# EAGLE schematic clock (EAGLE 7.1.0)
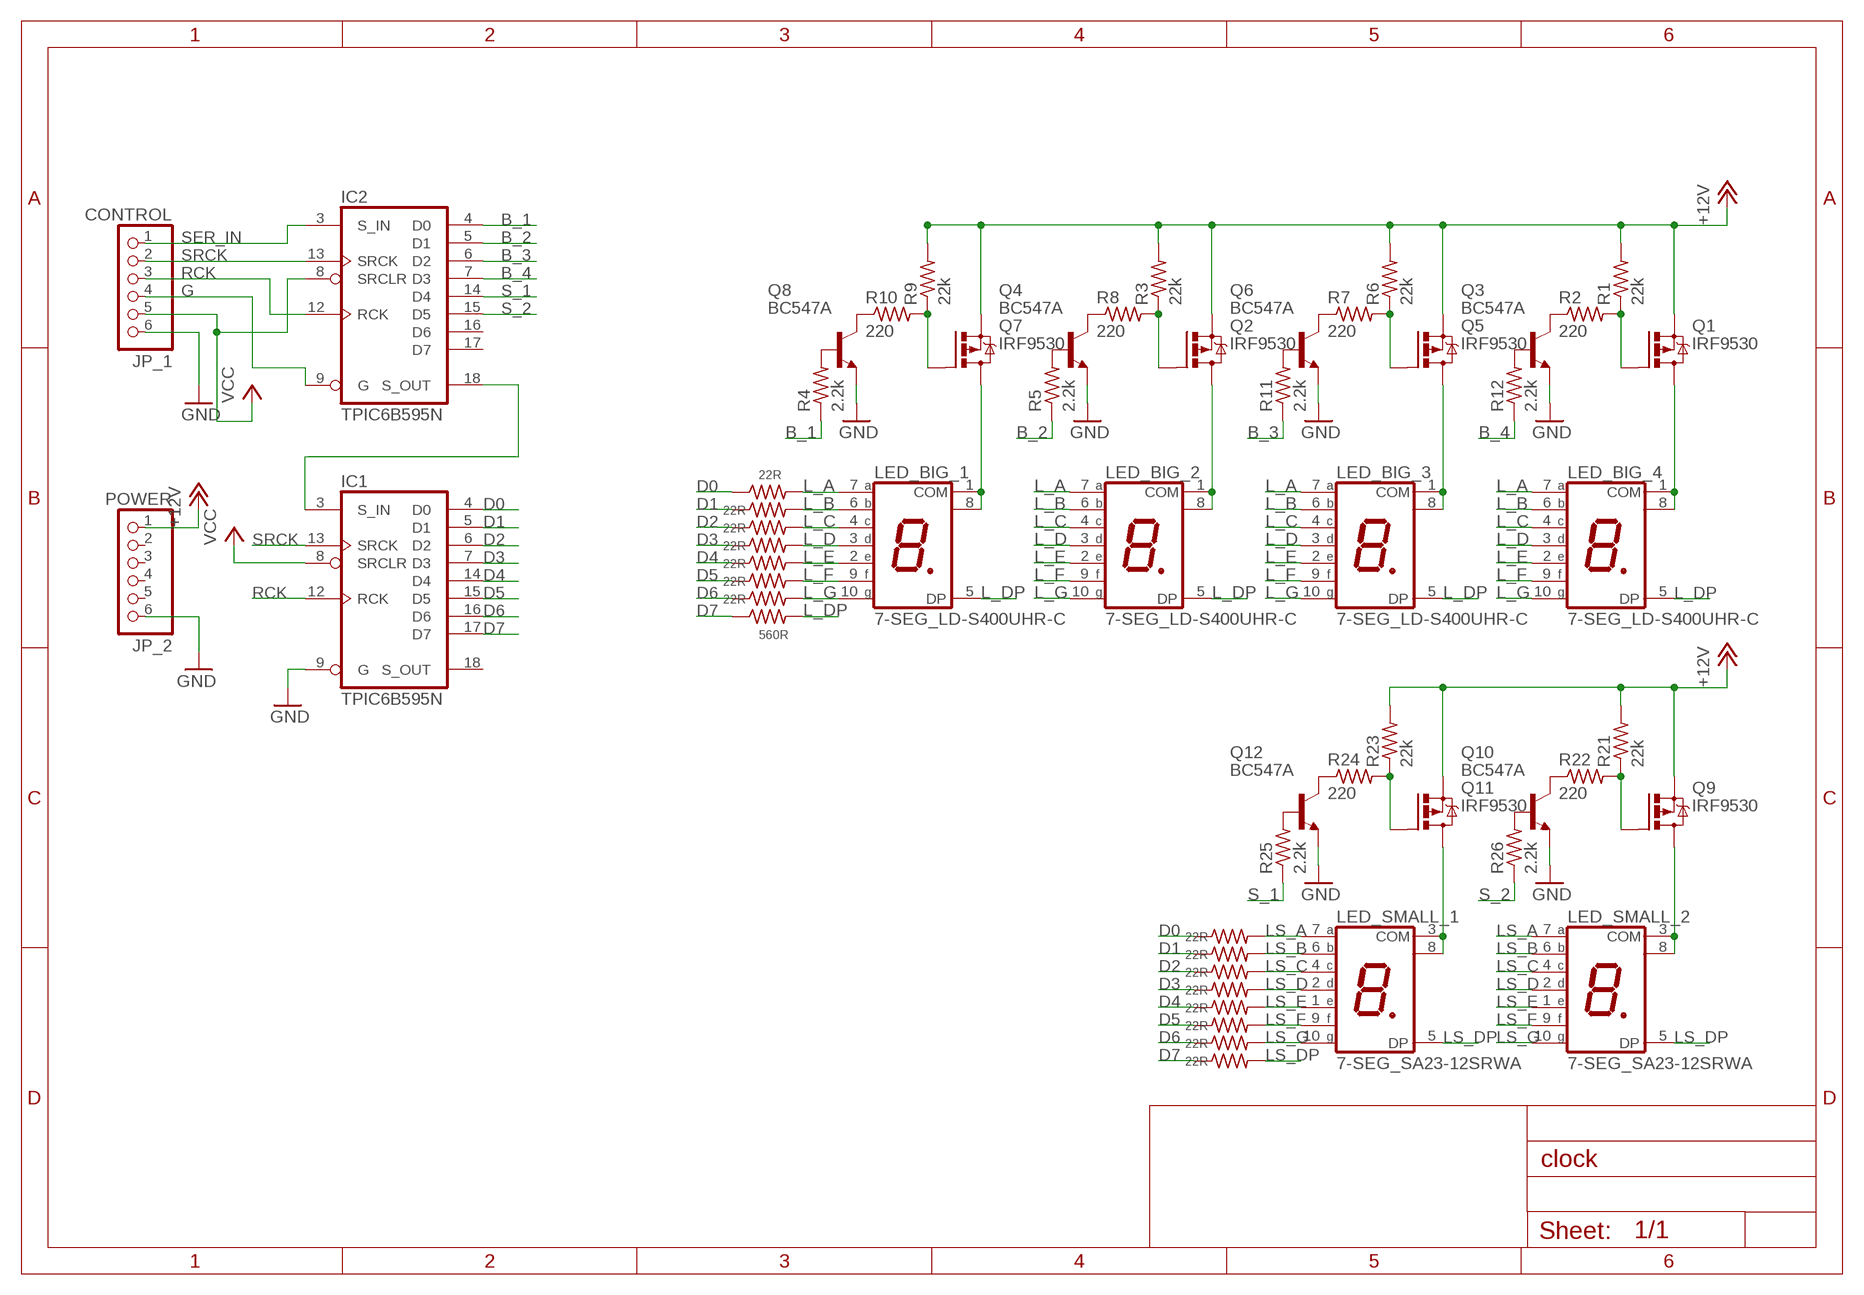
[diagram p0: schematic, sheet 1]

## Parts
CONTROL  JP_1  PINHD-1X6  [1X06]
IC1  TPIC6B595N  [DIL20]
IC2  TPIC6B595N  [DIL20]
LED_BIG_1  7-SEG_LD-S400UHR-C  [LD-S400UHR-C]
LED_BIG_2  7-SEG_LD-S400UHR-C  [LD-S400UHR-C]
LED_BIG_3  7-SEG_LD-S400UHR-C  [LD-S400UHR-C]
LED_BIG_4  7-SEG_LD-S400UHR-C  [LD-S400UHR-C]
LED_SMALL_1  7-SEG_SA23-12SRWA  [SA23-12SRWA]
LED_SMALL_2  7-SEG_SA23-12SRWA  [SA23-12SRWA]
POWER  JP_2  PINHD-1X6  [1X06]
Q1  IRF9530  [TO220BV]
Q2  IRF9530  [TO220BV]
Q3  BC547A  [TO92]
Q4  BC547A  [TO92]
Q5  IRF9530  [TO220BV]
Q6  BC547A  [TO92]
Q7  IRF9530  [TO220BV]
Q8  BC547A  [TO92]
Q9  IRF9530  [TO220BV]
Q10  BC547A  [TO92]
Q11  IRF9530  [TO220BV]
Q12  BC547A  [TO92]
R1  22k  R-US_0207/12  [0207/12]
R2  220  R-US_0207/12  [0207/12]
R3  22k  R-US_0207/12  [0207/12]
R4  2.2k  R-US_0207/12  [0207/12]
R5  2.2k  R-US_0207/12  [0207/12]
R6  22k  R-US_0207/12  [0207/12]
R7  220  R-US_0207/12  [0207/12]
R8  220  R-US_0207/12  [0207/12]
R9  22k  R-US_0207/12  [0207/12]
R10  220  R-US_0207/12  [0207/12]
R11  2.2k  R-US_0207/12  [0207/12]
R12  2.2k  R-US_0207/12  [0207/12]
R13  22R  R-US_0207/12  [0207/12]
R14  22R  R-US_0207/12  [0207/12]
R15  22R  R-US_0207/12  [0207/12]
R16  22R  R-US_0207/12  [0207/12]
R17  22R  R-US_0207/12  [0207/12]
R18  22R  R-US_0207/12  [0207/12]
R19  22R  R-US_0207/12  [0207/12]
R20  560R  R-US_0207/12  [0207/12]
R21  22k  R-US_0207/12  [0207/12]
R22  220  R-US_0207/12  [0207/12]
R23  22k  R-US_0207/12  [0207/12]
R24  220  R-US_0207/12  [0207/12]
R25  2.2k  R-US_0207/12  [0207/12]
R26  2.2k  R-US_0207/12  [0207/12]
R27  22R  R-US_0207/12  [0207/12]
R28  22R  R-US_0207/12  [0207/12]
R29  22R  R-US_0207/12  [0207/12]
R30  22R  R-US_0207/12  [0207/12]
R31  22R  R-US_0207/12  [0207/12]
R32  22R  R-US_0207/12  [0207/12]
R33  22R  R-US_0207/12  [0207/12]
R34  22R  R-US_0207/12  [0207/12]

## Nets
+12V: POWER.1 Q1.S Q2.S Q5.S Q7.S Q9.S Q11.S R1.2 R3.2 R6.2 R9.2 R21.2 R23.2
B_1: IC2.4(D0) R4.1
B_2: IC2.5(D1) R5.1
B_3: IC2.6(D2) R11.1
B_4: IC2.7(D3) R12.1
D0: IC1.4(D0) R13.1 R27.1
D1: IC1.5(D1) R14.1 R28.1
D2: IC1.6(D2) R15.1 R29.1
D3: IC1.7(D3) R16.1 R30.1
D4: IC1.14(D4) R17.1 R31.1
D5: IC1.15(D5) R18.1 R32.1
D6: IC1.16(D6) R19.1 R33.1
D7: IC1.17(D7) R20.1 R34.1
G: CONTROL.4 IC2.9(G)
GND: CONTROL.6 IC1.9(G) POWER.6 Q3.1(E) Q4.1(E) Q6.1(E) Q8.1(E) Q10.1(E) Q12.1(E)
L_A: LED_BIG_1.7(A) LED_BIG_2.7(A) LED_BIG_3.7(A) LED_BIG_4.7(A) R13.2
L_B: LED_BIG_1.6(B) LED_BIG_2.6(B) LED_BIG_3.6(B) LED_BIG_4.6(B) R14.2
L_C: LED_BIG_1.4(C) LED_BIG_2.4(C) LED_BIG_3.4(C) LED_BIG_4.4(C) R15.2
L_D: LED_BIG_1.3(D) LED_BIG_2.3(D) LED_BIG_3.3(D) LED_BIG_4.3(D) R16.2
L_DP: LED_BIG_1.5(DP) LED_BIG_2.5(DP) LED_BIG_3.5(DP) LED_BIG_4.5(DP) R20.2
L_E: LED_BIG_1.2(E) LED_BIG_2.2(E) LED_BIG_3.2(E) LED_BIG_4.2(E) R17.2
L_F: LED_BIG_1.9(F) LED_BIG_2.9(F) LED_BIG_3.9(F) LED_BIG_4.9(F) R18.2
L_G: LED_BIG_1.10(G) LED_BIG_2.10(G) LED_BIG_3.10(G) LED_BIG_4.10(G) R19.2
LS_A: LED_SMALL_1.7(A) LED_SMALL_2.7(A) R27.2
LS_B: LED_SMALL_1.6(B) LED_SMALL_2.6(B) R28.2
LS_C: LED_SMALL_1.4(C) LED_SMALL_2.4(C) R29.2
LS_D: LED_SMALL_1.2(D) LED_SMALL_2.2(D) R30.2
LS_DP: LED_SMALL_1.5(DP) LED_SMALL_2.5(DP) R34.2
LS_E: LED_SMALL_1.1(E) LED_SMALL_2.1(E) R31.2
LS_F: LED_SMALL_1.9(F) LED_SMALL_2.9(F) R32.2
LS_G: LED_SMALL_1.10(G) LED_SMALL_2.10(G) R33.2
N$1: LED_BIG_4.1(COM) LED_BIG_4.8(COM) Q1.D
N$2: Q1.G R1.1 R2.2
N$3: Q3.3(C) R2.1
N$4: LED_BIG_3.1(COM) LED_BIG_3.8(COM) Q5.D
N$5: Q5.G R6.1 R7.2
N$6: Q6.3(C) R7.1
N$7: Q2.G R3.1 R8.2
N$8: Q4.3(C) R8.1
N$9: LED_BIG_2.1(COM) LED_BIG_2.8(COM) Q2.D
N$10: Q7.G R9.1 R10.2
N$11: Q8.3(C) R10.1
N$12: LED_BIG_1.1(COM) LED_BIG_1.8(COM) Q7.D
N$13: Q8.2(B) R4.2
N$14: Q4.2(B) R5.2
N$15: Q6.2(B) R11.2
N$16: Q3.2(B) R12.2
N$17: IC1.3(S_IN) IC2.18(S_OUT)
N$42: LED_SMALL_2.3(COM) LED_SMALL_2.8(COM) Q9.D
N$43: Q9.G R21.1 R22.2
N$44: Q10.3(C) R22.1
N$45: Q11.G R23.1 R24.2
N$46: Q12.3(C) R24.1
N$47: LED_SMALL_1.3(COM) LED_SMALL_1.8(COM) Q11.D
N$48: Q12.2(B) R25.2
N$49: Q10.2(B) R26.2
RCK: CONTROL.3 IC1.12(RCK) IC2.12(RCK)
S_1: IC2.14(D4) R25.1
S_2: IC2.15(D5) R26.1
SER_IN: CONTROL.1 IC2.3(S_IN)
SRCK: CONTROL.2 IC1.13(SRCK) IC2.13(SRCK)
VCC: CONTROL.5 IC1.8(SRCLR) IC2.8(SRCLR)
Unconnected: IC1.18(S_OUT) IC2.16(D6) IC2.17(D7) POWER.2 POWER.3 POWER.4 POWER.5

## Power pins joined to a net without a drawn wire
GND: IC1.10(GND) IC1.11(GND) IC1.19(GND) IC2.10(GND) IC2.11(GND) IC2.19(GND)
VCC: IC1.2(VCC) IC2.2(VCC)

## Library data of the parts
CONTROL POWER = pinhead:PINHD-1X6: PIN HEADER
IC1 IC2 = NumericDisplay:TPIC6B595: 8-bit SHIFT REGISTER, output latch
LED_BIG_1-LED_BIG_4 LED_SMALL_1 LED_SMALL_2 = NumericDisplay:7-SEG_: Kingbright 14.2mm (0.56 INCH) SINGLE DIGIT NUMERIC DUISPLAY Source: SA56-11EWA(Ver1189471036.pdf
Q1 Q2 Q5 Q7 Q9 Q11 = transistor-power:IRF9530: P-CHANNEL HEXFET POWER-MOS-FET Source: http://www.irf.com/product-info/datasheets/data/irf9530.pdf
Q3 Q4 Q6 Q8 Q10 Q12 = transistor-npn:BC547*: NPN Transistor
R1-R34 = resistor:R-US_: RESISTOR, American symbol